# Altium schematic sheet Warm White LEDs.SchDoc: Warm White
size A4; SheetNumber: 2; SheetTotal: 4
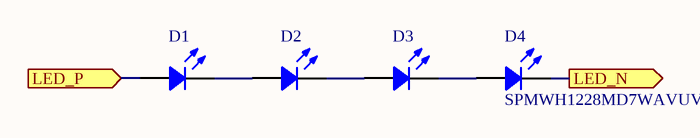
[diagram p0: Warm White LEDs.SchDoc]

## Parts
D1  SPMWH1228MD7WAVUVK  [SAMSUNG LM281BPLUS]  (value not drawn)
D2  SPMWH1228MD7WAVUVK  [SAMSUNG LM281BPLUS]  (value not drawn)
D3  SPMWH1228MD7WAVUVK  [SAMSUNG LM281BPLUS]  (value not drawn)
D4  SPMWH1228MD7WAVUVK  [SAMSUNG LM281BPLUS]

## Ports
LED_N (out), LED_P (in)

## Nets
LED_N: D4.C ; port LED_N
LED_P: D1.A ; port LED_P
NetD1_C: D1.C D2.A
NetD2_C: D2.C D3.A
NetD3_C: D3.C D4.A

## Notes on the sheet
- Title
- Size:
- Date:
- A4
- Number:
- Time:
- Revision:
- Sheet
- of
- File:

## Library data of the parts
D1-D4 = SPMWH1228MD7WAVUVK: LED; Manufacturer: Samsung Semiconductor, Inc.; CCT (K): 3000K 3-Step MacAdam Ellipse; Color: White, Warm; CRI (Color Rendering Index): 90; Current - Max: 200mA; Current - Test: 65mA; Flux @ 25°C, Current - Test: 30lm (29lm ~ 31lm); Lumens/Watt @ Current - Test: 165 lm/W; Viewing Angle: 120°; Voltage - Forward (Vf) (Typ): 2.8V; Part Number: SPMWH1228MD7WAVUVK; ComponentLink1Description: Datasheet; ComponentLink1URL: https://cdn.samsung.com/led/file/resource/2020/07/Data_Sheet_LM281B_Plus_Pro_VK_Rev.0.8.pdf; ComponentLink2Description: DigiKey Link; ComponentLink2URL: https://www.digikey.com/en/products/detail/samsung-semiconductor-inc/SPMWH1228MD7WAVUVK/12083623; Height - Seated (Max): 0.030" (0.75mm); LastUpdated: 21/03/2022 19:15:16; Lifecycle Status: Active; Minimum Order: 1; Mounting Type: Surface Mount; Packaging: TapeAndReel; PartId: 112; Part Status: Active; Price: 0.03; Series: LM281B+; Size / Dimension: 0.138" L x 0.110" W (3.50mm x 2.80mm); Supplier 1: DigiKey; Supplier Part Number 1: 1510-SPMWH1228MD7WAVUVKCT-ND; Supplier Device Package: 2835